# EAGLE design Radio_Module (EAGLE 8.3.2)
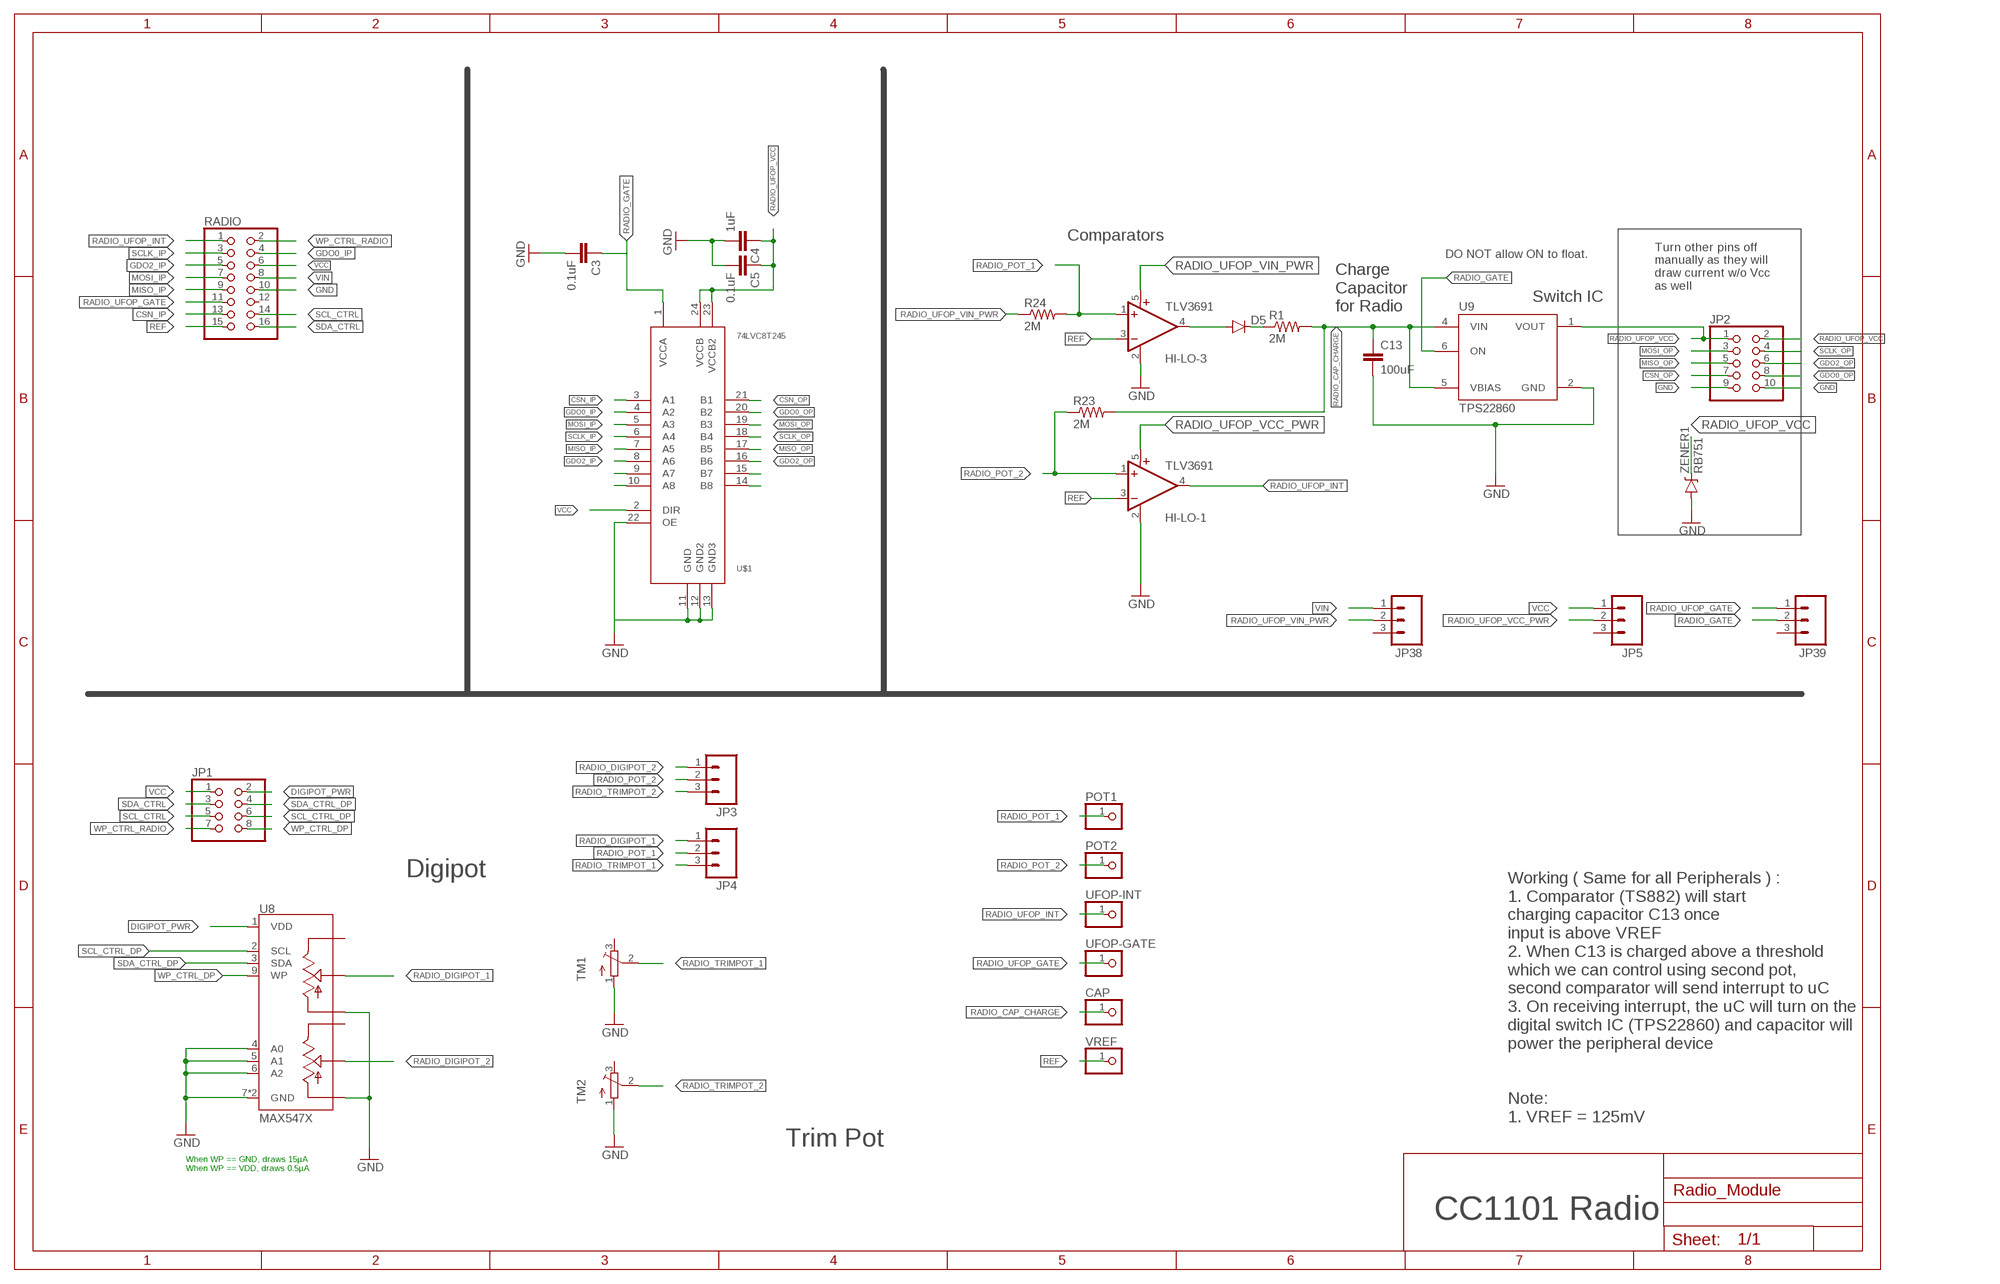
[diagram p0: schematic, sheet 1]

## Parts
C3  0.1uF  CAP0805  [0805]
C4  1uF  CAP0805  [0805]
C5  0.1uF  CAP0805  [0805]
C13  100uF  CAP0805  [0805]
CAP  PINHD-1X1  [1X01]
D5  DIODESOD523  [SOD523]
HI-LO-1  TLV3691  [SC70-5]
HI-LO-3  TLV3691  [SC70-5]
JP1  PINHD-2X4  [2X04]
JP2  PINHD-2X5  [2X05]
JP3  M03  [1X03-1.27MM]
JP4  M03  [1X03-1.27MM]
JP5  M03  [1X03-1.27MM]
JP38  M03  [1X03-1.27MM]
JP39  M03  [1X03-1.27MM]
POT1  PINHD-1X1  [1X01]
POT2  PINHD-1X1  [1X01]
R1  2M  RESISTOR0805-RES  [0805]
R23  2M  RESISTOR0805-RES  [0805]
R24  2M  RESISTOR0805-RES  [0805]
RADIO  PINHD-2X8/90  [2X08/90]
TM1  TRIMPOTTC33X  [TC33X]
TM2  TRIMPOTTC33X  [TC33X]
U8  MAX547X  [QFN16]
U9  TPS22860  [TSOT23-6]
U$1  74LVC8T245  [TSSOP24]
UFOP-GATE  PINHD-1X1  [1X01]
UFOP-INT  PINHD-1X1  [1X01]
VREF  PINHD-1X1  [1X01]
ZENER1  RB751  DIODE-ZENER  [SOD-523]

## Nets
CSN_IP: RADIO.13 U$1.3(A1)
CSN_OP: JP2.7 U$1.21(B1)
DIGIPOT_PWR: JP1.2 U8.1(VDD)
GDO0_IP: RADIO.4 U$1.4(A2)
GDO0_OP: JP2.8 U$1.20(B2)
GDO2_IP: RADIO.5 U$1.8(A6)
GDO2_OP: JP2.6 U$1.16(B6)
GND: C3.2 C4.2 C5.2 C13.2 HI-LO-1.2(GND) HI-LO-3.2(GND) JP2.9 JP2.10 RADIO.10 TM1.1(A) TM2.1(A) U8.4(A0) U8.5(A1) U8.6(A2) U8.7(GND) U8.10(LB) U8.13(LA) U8.TH(GND) U9.2(GND) U$1.11(GND) U$1.12(GND2) U$1.13(GND3) U$1.22(OE) ZENER1.ANODE(A)
MISO_IP: RADIO.9 U$1.7(A5)
MISO_OP: JP2.5 U$1.17(B5)
MOSI_IP: RADIO.7 U$1.5(A3)
MOSI_OP: JP2.3 U$1.19(B3)
N$1: D5.C R1.1
N$13: U$1.15(B7)
N$14: U$1.14(B8)
N$21: U$1.9(A7)
N$23: U$1.10(A8)
N$24: D5.A HI-LO-3.4(OUT)
RADIO_CAP_CHARGE: C13.1 CAP.1 R1.2 R23.2 U9.4(VIN) U9.5(VBIAS)
RADIO_DIGIPOT_1: JP4.1 U8.14(WA)
RADIO_DIGIPOT_2: JP3.1 U8.11(WB)
RADIO_GATE: C3.1 JP39.2 U9.6(ON) U$1.1(VCCA)
RADIO_POT_1: HI-LO-3.1(+IN) JP4.2 POT1.1 R24.2
RADIO_POT_2: HI-LO-1.1(+IN) JP3.2 POT2.1 R23.1
RADIO_TRIMPOT_1: JP4.3 TM1.2(S)
RADIO_TRIMPOT_2: JP3.3 TM2.2(S)
RADIO_UFOP_GATE: JP39.1 RADIO.11 UFOP-GATE.1
RADIO_UFOP_INT: HI-LO-1.4(OUT) RADIO.1 UFOP-INT.1
RADIO_UFOP_VCC: C4.1 C5.1 JP2.1 JP2.2 U9.1(VOUT) U$1.23(VCCB2) U$1.24(VCCB) ZENER1.CATHODE(C)
RADIO_UFOP_VCC_PWR: HI-LO-1.5(V+) JP5.2
RADIO_UFOP_VIN_PWR: HI-LO-3.5(V+) JP38.2 R24.1
REF: HI-LO-1.3(-IN) HI-LO-3.3(-IN) RADIO.15 VREF.1
SCL_CTRL: JP1.5 RADIO.14
SCL_CTRL_DP: JP1.6 U8.2(SCL)
SCLK_IP: RADIO.3 U$1.6(A4)
SCLK_OP: JP2.4 U$1.18(B4)
SDA_CTRL: JP1.3 RADIO.16
SDA_CTRL_DP: JP1.4 U8.3(SDA)
VCC: JP1.1 JP5.1 RADIO.6 U$1.2(DIR)
VIN: JP38.1 RADIO.8
WP_CTRL_DP: JP1.8 U8.9(WP)
WP_CTRL_RADIO: JP1.7 RADIO.2
Unconnected: JP5.3 JP38.3 JP39.3 RADIO.12 TM1.3(E) TM2.3(E) U8.12(HB) U8.15(HA)

## Notes on the sheet
- Comparators
- DO NOT allow ON to float.
- Charge 
  Capacitor 
  for Radio
- Turn other pins off 
  manually as they will
  draw current w/o Vcc
  as well
- Switch IC
- Digipot
- Working ( Same for all Peripherals ) :
  1. Comparator (TS882) will start 
  charging capacitor C13 once 
  input is above VREF
  2. When C13 is charged above a threshold
  which we can control using second pot, 
  second comparator will send interrupt to uC
  3. On receiving interrupt, the uC will turn on the
  digital switch IC (TPS22860) and capacitor will 
  power the peripheral device
- Note:
  1. VREF = 125mV
- Trim Pot
- When WP == GND, draws 15µA
  When WP == VDD, draws 0.5µA
- CC1101 Radio

## Library data of the parts
C3-C5 = SparkFun-Capacitors:CAP: Capacitor Standard 0603 ceramic capacitor, and 0.1" leaded capacitor.
C13 = SparkFun-Capacitors:CAP: Capacitor Standard 0603 ceramic capacitor, and 0.1" leaded capacitor.; DIGIKEY: 490-9969-1-ND
CAP POT1 POT2 UFOP-GATE UFOP-INT VREF = adafruit:PINHD-1X1: Pin header 1x1 for 0.1" spacing With round pins
D5 = SparkFun-DiscreteSemi:DIODE: Diode These are standard reverse protection diodes and small signal diodes. SMA package can handle up to about 1A. SOD-323 can handle about 200mA. What the SOD-323 package when ordering, there are some mfgs out there that are 5-pin packages.
HI-LO-1 HI-LO-3 = fedpower:TLV3691: 0.9-V to 6.5-V, Nanopower Comparator Datasheets Analog Signal Chain Guide <http://www.ti.com/lit/pdf/slyb174> TLV3691 <http://www.ti.com/lit/ds/symlink/tlv3691.pdf> Manufacturer Product Page TLV3691IDPFR Specifications <http://www.ti.com/general/docs/suppproductinfo.tsp?distId=10&orderablePartNumber=TLV3691IDPFR> Standard Package <javascript:dlgHelp('Standard%20Packaging%20Help');> 1 Category Integrated Circuits (ICs) </product-search/en/integrated-circuits-ics> Family Linear - Comparators </product-search/en/integrated-circuits-ics/linear-comparators/2556221> Series - Packaging <javascript:dlgHelp('Standard%20Packaging%20Help');> Cut Tape (CT) <javascript:dlgHelp('Cut%20Tape%20Help');> Type General Purpose Number of Elements 1 Output Type Push-Pull Voltage - Supply, Single/Dual (±) 0.9 V ~ 6.5 V, ±0.45 V ~ 3.25 V Voltage - Input Offset (Max) 3mV Current - Input Bias (Max) 100pA Current - Output (Typ) 42mA Current - Quiescent (Max) 150nA CMRR, PSRR (Typ) - Propagation Delay (Max) 35µs Hysteresis - Operating Temperature -40°C ~ 125°C Package / Case 6-XFDFN Mounting Type Surface Mount Supplier Device Package 6-X2SON (1x1) Online Catalog Comparators - 1 element </catalog/en/partgroup/comparators-1-element/3112?mpart=TLV3691IDPFR&vendor=296&WT.z_ref_page_type=PS&WT.z_ref_page_sub_type=PD&WT.z_ref_page_id=PD&WT.z_ref_page_event=DC_Link_Table> Other Names 296-37242-1
JP1 = pinhead:PINHD-2X4: PIN HEADER
JP2 = pinhead:PINHD-2X5: PIN HEADER
JP3-JP5 JP38 JP39 = SparkFun-Connectors:M03: Header 3 Standard 3-pin 0.1" header. Use with straight break away headers (SKU : PRT-00116), right angle break away headers (PRT-00553), swiss pins (PRT-00743), machine pins (PRT-00117), and female headers (PRT-00115). Molex polarized connector foot print use with SKU : PRT-08232 with associated crimp pins and housings.
R1 R23 = SparkFun-Resistors:RESISTOR: Resistor Basic schematic elements and footprints for 0603, 1206, and PTH resistors.; DIGIKEY: 311-2.00MHRCT-ND
R24 = SparkFun-Resistors:RESISTOR: Resistor Basic schematic elements and footprints for 0603, 1206, and PTH resistors.
RADIO = pinhead:PINHD-2X8: PIN HEADER
TM1 TM2 = adafruit:TRIMPOT: SMT trimmer potentiometer part number TC33X http://www.ladyada.net/library/eagle
U8 = max547x:MAX547X: MAXIM MAX547X: Dual, 256-Tap, Nonvolatile, I2C-Interface, Digital Potentiometers, 400nA Iq, 250µA 12ms write The MAX5477/MAX5478/MAX5479 nonvolatile, dual, linear-taper, digital potentiometers perform the function of a mechanical potentiometer, but replace the mechanics with a simple 2-wire digital interface. Each device performs the same function as a discrete potentiometer or variable resistor and has 256 tap points. The devices feature an internal, nonvolatile EEPROM used to store the wiper position for initialization during power-up. A write-protect feature prevents accidental overwrites of the EEPROM. The fast-mode I2C-compatible serial interface allows communication at data rates up to 400kbps, minimizing board space and reducing interconnection complexity in many applications. Three address inputs allow a total of eight unique address combinations.; DIGIKEY: MAX5479ETE+-ND
U9 = tps22860:TPS22860: TI: TPS22860 Ultra-Low Leakage Load Switch The TPS22860 is a small, ultra-low leakage current, single channel load switch. The device requires a VBIAS voltage and can operate over an input voltage range of 0 V to VBIAS. It can support a maximum continuous current of 200 mA. The switch is controlled by an on/off input (ON), which is capable of interfacing directly with low-voltage control signals. The TPS22860 is available in two small, space-saving 6-pin SOT-23 and SC70 packages. The device is characterized for operation over the free-air temperature range of –40°C to 85°C.; DIGIKEY: 296-43982-1-ND
U$1 = 74lvc8t245:74LVC8T245
ZENER1 = Parts:DIODE-ZENER: Zener Diode Production Part - 8199 3.4V Zener Voltage

## Board
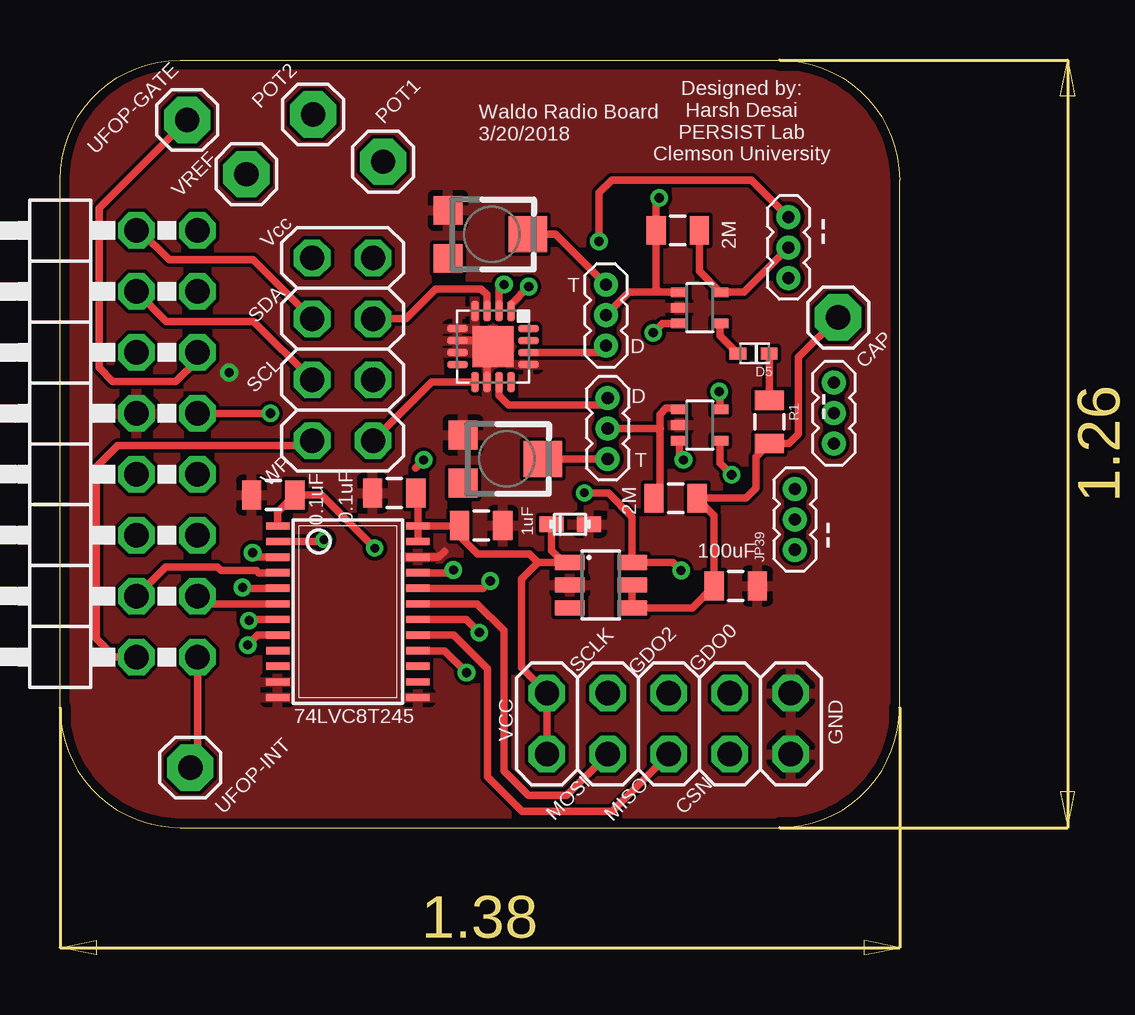
[diagram p1: board, top side]
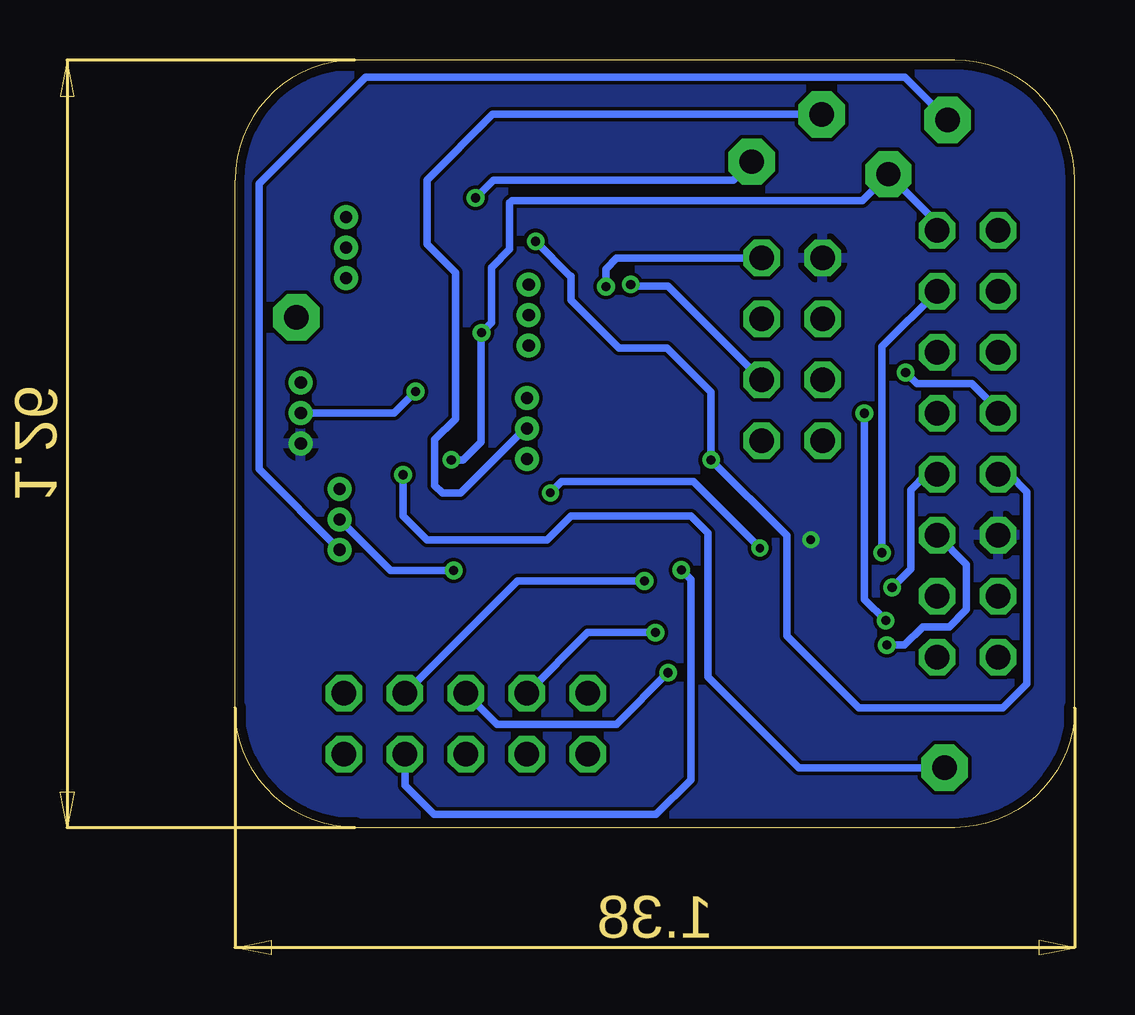
[diagram p2: board, bottom side, seen from below]

Size 35 x 32 mm. Coordinates in mm from the lower left corner, seen from the top.
Outline: 5,0 30,0 arc90 35,5 35,27 arc90 30,32 5,32 arc90 0,27 0,5 arc90 5,0
Copper layers (1*16): Top 0.0356mm / dielectric 1.5011mm / Bottom 0.0356mm
Design rules "oshpark-2layer": minimum track width 6mil, minimum drill 13mil, track to track 6mil, track to pad 6mil, pad to pad 6mil, via to via 6mil, smd to smd 6mil, copper to edge 15mil, drill to drill 6mil, minimum pad ring 7mil, minimum via ring 7mil, stop-mask expansion 2.5mil, vias tented up to drill 0mil, thermal gap 10mil

### Footprints (pad centres in the part's own frame; a part is rotated, then mirrored left to right if it is on the bottom)
0805 = smd 0.8 x 1.2: 1 -0.9,0; 2 0.9,0
1X01 = drill 1.016 pad 1.93 octagon: 1 0,0
SOD523 = smd 0.7 x 0.5: A 0.7,0; C -0.6,0
SC70-5 = smd 0.4 x 0.7: 1 -0.65,-0.85; 2 0,-0.85; 3 0.65,-0.85; 4 0.65,0.85; 5 -0.65,0.85
2X04 = drill 1.016 octagon: 1 -3.81,-1.27; 2 -3.81,1.27; 3 -1.27,-1.27; 4 -1.27,1.27; 5 1.27,-1.27; 6 1.27,1.27; 7 3.81,-1.27; 8 3.81,1.27
2X05 = drill 1.016 octagon: 1 -5.08,-1.27; 2 -5.08,1.27; 3 -2.54,-1.27; 4 -2.54,1.27; 5 0,-1.27; 6 0,1.27; 7 2.54,-1.27; 8 2.54,1.27; 9 5.08,-1.27; 10 5.08,1.27
1X03-1.27MM = drill 0.508 pad 1: 1 -1.27,0; 2 0,0; 3 1.27,0
2X08/90 = drill 1.016 octagon: 1 -8.89,-6.35; 2 -8.89,-3.81; 3 -6.35,-6.35; 4 -6.35,-3.81; 5 -3.81,-6.35; 6 -3.81,-3.81; 7 -1.27,-6.35; 8 -1.27,-3.81; 9 1.27,-6.35; 10 1.27,-3.81; 11 3.81,-6.35; 12 3.81,-3.81; 13 6.35,-6.35; 14 6.35,-3.81; 15 8.89,-6.35; 16 8.89,-3.81
TC33X = smd 1.2 x 1.2: 1 -1,-1.825; 3 1,-1.825 | smd 1.5 x 1.6: 2 0,1.5
QFN16 = smd 0.85 x 0.3: 1 -1.475,0.75; 2 -1.475,0.25; 3 -1.475,-0.25; 4 -1.475,-0.75; 9 1.475,-0.75; 10 1.475,-0.25; 11 1.475,0.25; 12 1.475,0.75 | smd 0.3 x 0.85: 5 -0.75,-1.475; 6 -0.25,-1.475; 7 0.25,-1.475; 8 0.75,-1.475; 13 0.75,1.475; 14 0.25,1.475; 15 -0.25,1.475; 16 -0.75,1.475 | smd 1.7 x 1.7: TH 0,0
TSOT23-6 = smd 0.62 x 1.22: 1 -0.95,-1.3; 2 0,-1.3; 3 0.95,-1.3; 4 0.95,1.3; 5 0,1.3; 6 -0.95,1.3
TSSOP24 = smd 0.305 x 0.991: 1 -3.575,-2.918; 2 -2.925,-2.918; 3 -2.275,-2.918; 4 -1.625,-2.918; 5 -0.975,-2.918; 6 -0.325,-2.918; 7 0.325,-2.918; 8 0.975,-2.918; 9 1.625,-2.918; 10 2.275,-2.918; 11 2.925,-2.918; 12 3.575,-2.918; 13 3.575,2.918; 14 2.925,2.918; 15 2.275,2.918; 16 1.625,2.918; 17 0.975,2.918; 18 0.325,2.918; 19 -0.325,2.918; 20 -0.975,2.918; 21 -1.625,2.918; 22 -2.275,2.918; 23 -2.925,2.918; 24 -3.575,2.918
SOD-523 = smd 1 x 0.635: ANODE -0.8,0; CATHODE 0.76,0

### Placement (x,y rotation side)
C3  8.89,13.86 180 top
C4  17.56,12.59 0 top
C5  13.93,13.95 180 top
C13  28.17,10.07 0 top
CAP  32.44,21.27 0 top
D5  28.96,19.77 180 top
HI-LO-1  26.67,16.78 270 top
HI-LO-3  26.67,21.67 270 top
JP1  11.78,19.94 270 top
JP2  25.38,4.33 0 top
JP3  22.83,16.64 270 top
JP4  22.76,21.36 90 top
JP5  32.26,17.28 90 top
JP38  30.37,24.18 270 top
JP39  30.64,12.85 90 top
POT1  13.47,27.76 0 top
POT2  10.55,29.73 0 top
R1  29.57,16.92 270 top
R23  25.66,13.73 0 top
R24  25.75,24.9 180 top
RADIO  -0.62,16 90 top
TM1  18,24.73 270 top
TM2  18.63,15.37 270 top
U8  18.05,20.05 270 top
U9  22.55,10.11 270 top
U$1  12,9 270 top
UFOP-GATE  5.3,29.5 0 top
UFOP-INT  5.43,2.5 0 top
VREF  7.77,27.24 0 top
ZENER1  21.26,12.64 180 top

### Tracks (layer width: path | path; a pad name or v marks a point on that pad's centre or on a via)
CSN_IP  (via drill 0.38)
  Top 0.305: U$1.3 8.22,11.28 v8.03,11.46
  Bottom 0.305: v8.03,11.46 8.03,20.05 RADIO.13
CSN_OP  (via drill 0.38)
  Top 0.305: U$1.21 16.29,10.62 v16.4,10.74
  Bottom 0.305: JP2.7 27.92,1.77 26.7,0.55 18,0.55 | 17.92,0.55 18,0.55 | 18,0.55 17.45,0.55 16,2 16,10.34 v16.4,10.74
DIGIPOT_PWR  (via drill 0.38)
  Top 0.305: U8.1 18.8,21.81 v19.54,22.55
  Bottom 0.305: v19.54,22.55 19.54,23.29 19.1,23.73 13.07,23.73 JP1.2
GDO0_IP
  Top 0.305: RADIO.4 4.4,10.86 6.56,10.86 6.71,10.71 8.2,10.71 8.29,10.62 U$1.4
GDO0_OP  (via drill 0.38)
  Top 0.305: v17.94,10.28 17.63,9.97 U$1.20
  Bottom 0.305: v17.94,10.28 23.24,10.28 JP2.8
GDO2_IP  (via drill 0.38)
  Top 0.305: U$1.8 8.24,8.03 v7.83,7.61
  Bottom 0.305: v7.83,7.61 7.1,7.61 6.34,8.37 5.23,8.37 4.51,9.09 4.51,10.97 RADIO.5
GDO2_OP  (via drill 0.38)
  Top 0.305: U$1.16 16.04,7.38 v16.95,6.46
  Bottom 0.305: v16.95,6.46 19.11,4.3 24.08,4.3 JP2.6
GND  (via drill 0.38)
  Top 0.305: U8.6 17.8,20.3 U8.TH 17.8,19.8 U8.10 | U$1.22 15.79,11.28 16.03,11.52
  Bottom 0.305: RADIO.10 3.19,17.4 4.3,18.51 6.59,18.51 v7.05,18.97
  pour Top: -1,33 -1,-1 47,-1 47,33
MISO_IP  (via drill 0.38)
  Top 0.305: U$1.7 7.92,8.68 v7.88,8.63 | v8.77,17.27 RADIO.9
  Bottom 0.305: v8.77,17.27 8.77,9.52 v7.88,8.63
MISO_OP
  Top 0.305: JP2.5 23,0.68 19.25,0.68 17.82,2.11 17.82,6.61 16.41,8.03 U$1.17
MOSI_IP  (via drill 0.38)
  Top 0.305: U$1.5 7.64,9.97 v7.61,10.01
  Bottom 0.305: RADIO.7 6.19,14.73 6.84,14.08 6.84,10.79 v7.61,10.02 v7.61,10.01
MOSI_OP
  Top 0.305: U$1.19 17.39,9.32 18.51,8.21 18.51,2.37 19.54,1.34 21.12,1.34 JP2.3
N$1
  Top 0.305: D5.C R1.1
N$24
  Top 0.305: HI-LO-3.4 27.52,20.51 D5.A
RADIO_CAP_CHARGE
  Top 0.305: R23.2 26.53,13.7 | 26.37,13.54 R23.2 | 29.01,15.4 29.01,15 | 29.01,15 29.01,14.15 28.59,13.73 R23.2 | 23.89,10.07 U9.5 U9.4 26.36,9.16 C13.1 27.27,13.02 R23.2 | 29.01,15 29.01,15.46 R1.2 30.39,16.02 30.79,16.41 30.79,19.62 CAP.1
RADIO_DIGIPOT_1
  Top 0.305: U8.14 22.47,19.8 JP4.1
RADIO_DIGIPOT_2
  Top 0.305: U8.11 18.3,18.01 18.69,17.62 22.54,17.62 JP3.1
RADIO_GATE  (via drill 0.35, 0.38)
  Top 0.305: v25.89,10.72 25.55,11.06 U9.6 23.85,12.96 22.86,13.95 v21.86,13.95 | U$1.1 9.08,13.16 C3.1 10.91,13.86 v13.12,11.65
  Bottom 0.305: v25.89,10.72 28.51,10.72 JP39.2 | v21.86,13.95 21.39,14.42 15.89,14.42 v13.12,11.65
RADIO_POT_1  (via drill 0.38)
  Top 0.305: 25,22.32 HI-LO-3.1 | 25,22.32 23.72,22.32 JP4.2 | 25,22.32 24.85,22.47 R24.2 24.85,26.12 v24.98,26.25
  Bottom 0.305: v24.98,26.25 24.23,27 14.23,27 POT1.1
RADIO_POT_2
  Top 0.305: JP3.2 25,16.64 | 25,16.64 25.03,16.64 | 25,16.64 25,17.22 25.27,17.49 25.76,17.49 HI-LO-1.1 | 25,16.64 25,13.97 R23.1
  Bottom 0.305: JP3.2 22.91,16.64 25.61,13.94 26.36,13.94 26.68,14.26 26.68,16.18 25.82,17.04 25.82,23.14 27,24.32 27,27 24.27,29.73 POT2.1
RADIO_TRIMPOT_1
  Top 0.305: TM1.2 20.66,24.73 JP4.3
RADIO_TRIMPOT_2
  Top 0.305: TM2.2 JP3.3
RADIO_UFOP_GATE
  Top 0.305: RADIO.11 5.73,19.5 4.83,18.6 2.2,18.6 1.63,19.17 1.63,25.83 UFOP-GATE.1
  Bottom 0.305: UFOP-GATE.1 7.09,31.29 29.55,31.29 34,26.84 34,14.94 JP39.1
RADIO_UFOP_INT  (via drill 0.38)
  Top 0.305: RADIO.1 5.73,2.8 UFOP-INT.1 | HI-LO-1.4 27.52,15.19 v28,14.71
  Bottom 0.305: UFOP-INT.1 11.5,2.5 15.29,6.29 15.29,12.28 16,12.99 16,13 21,13 22,12 27,12 28,13 v28,14.71
RADIO_UFOP_VCC
  Top 0.305: JP2.1 JP2.2 19.23,6.67 19.23,10.37 19.92,11.06 | 19.92,11.06 21,11.06 | 21,11.06 U9.1 | U$1.24 16.64,12.57 C4.1 16.66,12.15 17.41,11.4 19.58,11.4 19.92,11.06 | U$1.23 U$1.24 | U$1.24 14.92,13.86 C5.1 | ZENER1.CATHODE 20.5,11.56 21,11.06
RADIO_UFOP_VCC_PWR  (via drill 0.38)
  Top 0.305: HI-LO-1.5 27.52,18.14 v27.48,18.18
  Bottom 0.305: JP5.2 28.38,17.28 v27.48,18.18
RADIO_UFOP_VIN_PWR
  Top 0.305: R24.1 26.65,23.19 HI-LO-3.5 28.51,22.32 JP38.2
REF  (via drill 0.38)
  Top 0.305: HI-LO-3.3 25.12,21.02 v24.73,20.63 | HI-LO-1.3 25.82,15.5 v25.99,15.33
  Bottom 0.305: v25.99,15.33 25.49,15.33 24.74,16.08 v24.74,20.62 v24.73,20.63 24.31,21.05 24.31,23.35 23.55,24.11 23.55,26.05 23.46,26.14 8.86,26.14 VREF.1 | 5.73,25.16 RADIO.15 5.73,25.2 VREF.1 | VREF.1
SCL_CTRL
  Top 0.305: RADIO.14 4.43,21.1 8.08,21.1 JP1.5
SCL_CTRL_DP  (via drill 0.38)
  Top 0.305: v18.51,22.64 18.3,22.43 U8.2
  Bottom 0.305: JP1.6 16.95,22.57 18.44,22.57 v18.51,22.64
SCLK_IP
  Top 0.305: U$1.6 6.05,9.32 RADIO.3
SCLK_OP  (via drill 0.38)
  Top 0.305: U$1.18 16.93,8.68 v17.48,8.13
  Bottom 0.305: v17.48,8.13 20.31,8.13 JP2.4
SDA_CTRL
  Top 0.305: RADIO.16 3.33,24.89 4.55,23.67 8.05,23.67 JP1.3
SDA_CTRL_DP
  Top 0.305: JP1.4 14.42,21.21 15.66,22.45 17.56,22.45 17.8,22.21 U8.3
VCC  (via drill 0.35)
  Top 0.305: U$1.2 10.93,11.93 v11,12
  pour Bottom: -3,35 -3,-3 49,-3 49,35
VIN  (via drill 0.38)
  Top 0.305: 14.83,15 v15.16,15.33 | 22.47,24.87 v22.47,24.44 22.47,26.47 23,27 28.82,27 JP38.1
  Bottom 0.305: RADIO.8 2.73,14.73 2,14 2,6 3,5 9,5 12,8 12,12.17 v15.16,15.33 15.16,18.16 17,20 19,20 21,22 21,23 21.03,23 v22.47,24.44
WP_CTRL_DP
  Top 0.305: U8.9 15.49,18.57 JP1.8
WP_CTRL_RADIO
  Top 0.305: RADIO.2 2.29,7.11 1.51,7.89 1.51,15.04 2.4,15.93 10.31,15.93 JP1.7

### Text on the board
tPlace: Waldo Radio Board / 3/20/2018 | Designed by: / Harsh Desai / PERSIST Lab / Clemson University | -- | Vcc | T | SDA | D | SCL | D | -- | T | WP | -- | GDO0 | SCLK | GDO2 | VCC | GND | MOSI | MISO | CSN